# EAGLE design esp07_12_shift_inout (EAGLE 7.3.0)
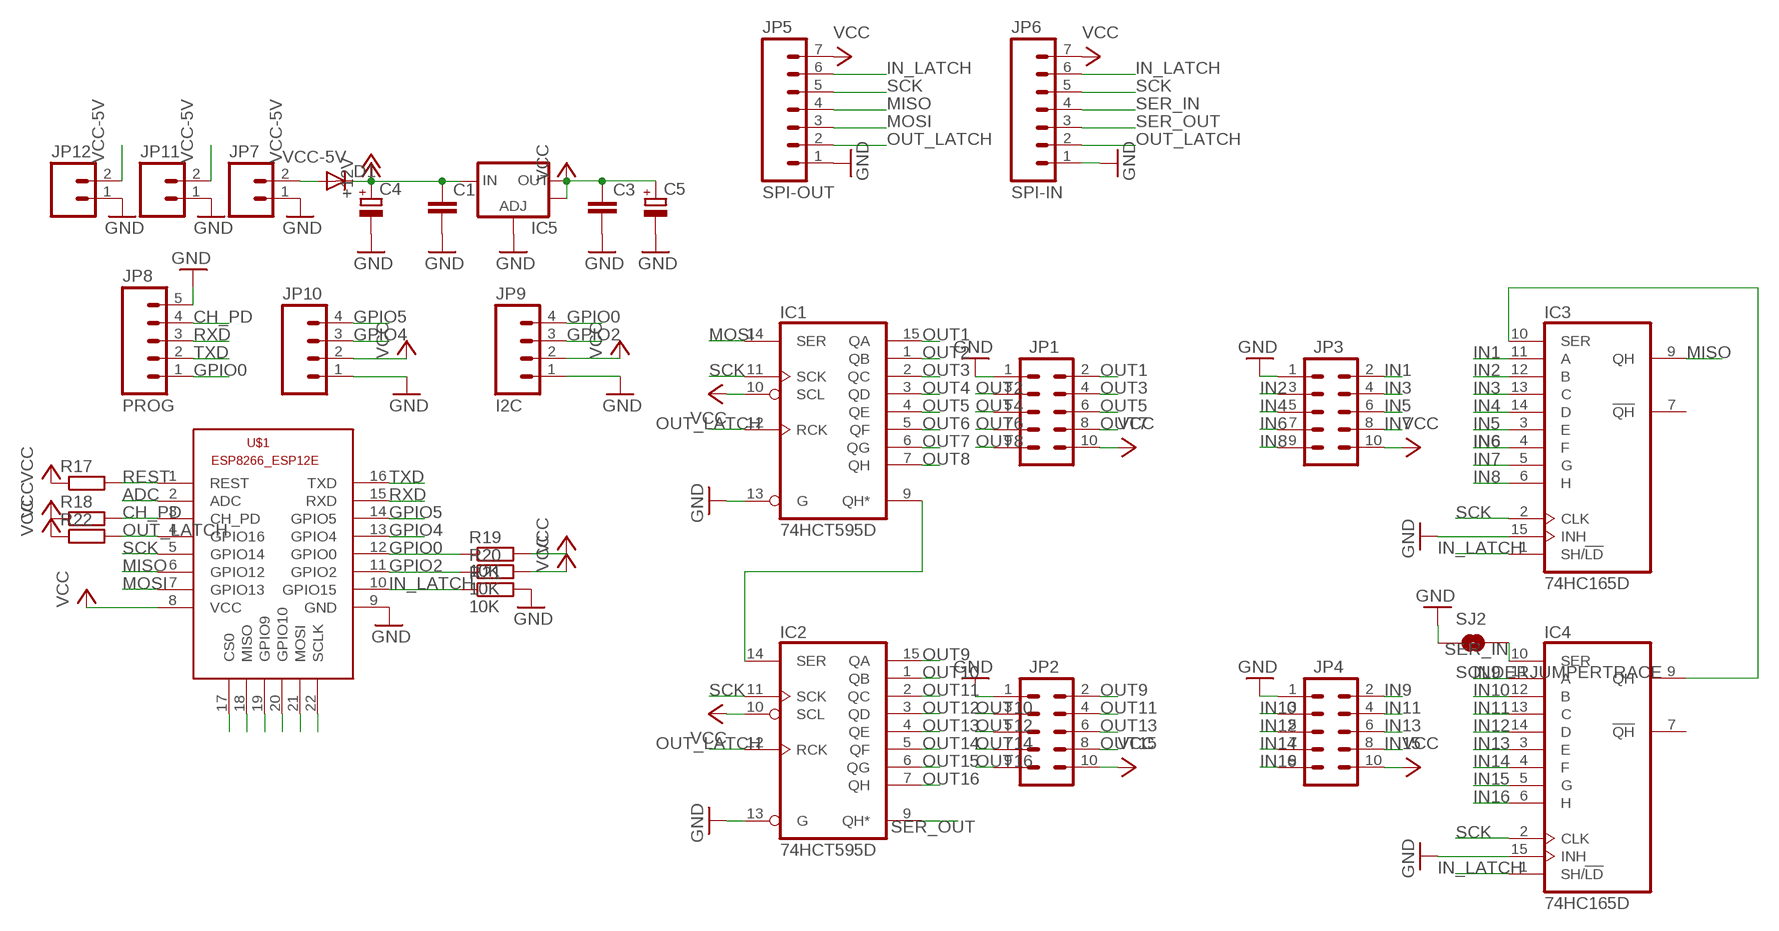
[diagram p0: schematic, sheet 1]

## Parts
C1  C-EUC0805  [C0805]
C3  C-EUC0805  [C0805]
C4  CPOL-EUD/7343-31R  [D/7343-31R]
C5  CPOL-EUD/7343-31R  [D/7343-31R]
D1  DIODE-DO214AC  [DO214AC]
IC1  74HCT595D  [SO16]
IC2  74HCT595D  [SO16]
IC3  74HC165D  [SO16]
IC4  74HC165D  [SO16]
IC5  V_REG_LM1117SOT223  [SOT223]
JP1  M05X2SHD  [2X5-SHROUDED]
JP2  M05X2SHD  [2X5-SHROUDED]
JP3  M05X2SHD  [2X5-SHROUDED]
JP4  M05X2SHD  [2X5-SHROUDED]
JP5  SPI-OUT  M07  [1X07]
JP6  SPI-IN  M07  [1X07]
JP7  M02PTH3  [1X02_LONGPADS]
JP8  PROG  M05PTH  [1X05]
JP9  I2C  M04PTH  [1X04]
JP10  M04PTH  [1X04]
JP11  M02PTH  [1X02]
JP12  M02PTH  [1X02]
R17  R-EU_R0603  [R0603]
R18  R-EU_R0603  [R0603]
R19  10K  R-EU_R0603  [R0603]
R20  10K  R-EU_R0603  [R0603]
R21  10K  R-EU_R0603  [R0603]
R22  R-EU_R0603  [R0603]
SJ2  SOLDERJUMPERTRACE  [SJ_2S-TRACE]
U$1  ESP8266-12EESP8266-ESP12E  [ESP8266-ESP12E]

## Nets
+12V: C1.1 C4.+ D1.C IC5.3(IN)
ADC: U$1.2(ADC)
CH_PD: JP8.4 R18.2 U$1.3(CH_PD)
GND: C1.2 C3.2 C4.- C5.- IC1.13(G) IC2.13(G) IC3.15(INH) IC4.15(INH) IC5.1(ADJ) JP1.1 JP2.1 JP3.1 JP4.1 JP5.1 JP6.1 JP7.1 JP8.5 JP9.1 JP10.1 JP11.1 JP12.1 R21.2 SJ2.1 U$1.9(GND)
GPIO0: JP8.1 JP9.4 R19.1 U$1.12(GPIO0)
GPIO2: JP9.3 R20.1 U$1.11(GPIO2)
GPIO4: JP10.3 U$1.13(GPIO4)
GPIO5: JP10.4 U$1.14(GPIO5)
IN1: IC3.11(A) JP3.2
IN2: IC3.12(B) JP3.3
IN3: IC3.13(C) JP3.4
IN4: IC3.14(D) JP3.5
IN5: IC3.3(E) JP3.6
IN6: IC3.4(F) JP3.7
IN7: IC3.5(G) JP3.8
IN8: IC3.6(H) JP3.9
IN9: IC4.11(A) JP4.2
IN10: IC4.12(B) JP4.3
IN11: IC4.13(C) JP4.4
IN12: IC4.14(D) JP4.5
IN13: IC4.3(E) JP4.6
IN14: IC4.4(F) JP4.7
IN15: IC4.5(G) JP4.8
IN16: IC4.6(H) JP4.9
IN_LATCH: IC3.1(SH/!LD) IC4.1(SH/!LD) JP5.6 JP6.6 R21.1 U$1.10(GPIO15)
MISO: IC3.9(QH) JP5.4 U$1.6(GPIO12)
MOSI: IC1.14(SER) JP5.3 U$1.7(GPIO13)
N$1: IC1.9(QH*) IC2.14(SER)
N$2: IC3.10(SER) IC4.9(QH)
N$35: U$1.17(CS0)
N$37: U$1.18(MISO)
N$38: U$1.19(GPIO9)
N$39: U$1.20(GPIO10)
N$40: U$1.21(MOSI)
N$41: U$1.22(SCLK)
OUT1: IC1.15(QA) JP1.2
OUT2: IC1.1(QB) JP1.3
OUT3: IC1.2(QC) JP1.4
OUT4: IC1.3(QD) JP1.5
OUT5: IC1.4(QE) JP1.6
OUT6: IC1.5(QF) JP1.7
OUT7: IC1.6(QG) JP1.8
OUT8: IC1.7(QH) JP1.9
OUT9: IC2.15(QA) JP2.2
OUT10: IC2.1(QB) JP2.3
OUT11: IC2.2(QC) JP2.4
OUT12: IC2.3(QD) JP2.5
OUT13: IC2.4(QE) JP2.6
OUT14: IC2.5(QF) JP2.7
OUT15: IC2.6(QG) JP2.8
OUT16: IC2.7(QH) JP2.9
OUT_LATCH: IC1.12(RCK) IC2.12(RCK) JP5.2 JP6.2 R22.2 U$1.4(GPIO16)
REST: R17.2 U$1.1(REST)
RXD: JP8.3 U$1.15(RXD)
SCK: IC1.11(SCK) IC2.11(SCK) IC3.2(CLK) IC4.2(CLK) JP5.5 JP6.5 U$1.5(GPIO14)
SER_IN: IC4.10(SER) JP6.4 SJ2.2
SER_OUT: IC2.9(QH*) JP6.3
TXD: JP8.2 U$1.16(TXD)
VCC: C3.1 C5.+ IC1.10(SCL) IC2.10(SCL) IC5.2(OUT) IC5.4(OUT) JP1.10 JP2.10 JP3.10 JP4.10 JP5.7 JP6.7 JP9.2 JP10.2 R17.1 R18.1 R19.2 R20.2 R22.1 U$1.8(VCC)
VCC-5V [power]: D1.A JP7.2 JP11.2 JP12.2
Unconnected: IC3.7(!QH) IC4.7(!QH)

## Power pins joined to a net without a drawn wire
GND: IC1.8(GND) IC2.8(GND) IC3.8(GND) IC4.8(GND)
VCC: IC1.16(VCC) IC2.16(VCC) IC3.16(VCC) IC4.16(VCC)

## Library data of the parts
C1 C3 = rcl:C-EU: CAPACITOR, European symbol
C4 C5 = rcl:CPOL-EU: POLARIZED CAPACITOR, European symbol
D1 = diode:DIODE-: DIODE
IC1 IC2 = 74xx-eu:74*595: 8-bit SHIFT REGISTER, output latch
IC3 IC4 = 74xx-eu:74*165: 8-bit parallel load SHIFT REGISTER
IC5 = SparkFun-PowerIC:V_REG_LM1117: Voltage Regulator LM1117 Standard adjustable voltage regulator but in SMD form. Spark Fun Electronics SKU : COM-00595
JP1-JP4 = SparkFun-Connectors:M05X2: Header 5x2 Standard 10-pin dual row 0.1" header. Commonly used with AVR-ISP. Use with Spark Fun Electronics SKU: PRT-00778
JP5 JP6 = SparkFun-Connectors:M07: Header 7 Standard 7-pin 0.1" header. Use with straight break away headers (SKU : PRT-00116), right angle break away headers (PRT-00553), swiss pins (PRT-00743), machine pins (PRT-00117), and female headers (PRT-00115). NOTES ON THE VARIANTS LOCK and LOCK_LONGPADS... This footprint was designed to help hold the alignment of a through-hole component (i.e. 7-pin header) while soldering it into place. You may notice that each hole has been shifted either up or down by 0.005 of an inch from it's more standard position (which is usually a perfectly straight line). This slight alteration caused the pins (the squares in the middle) to touch the edges of the holes. Because they are alternating, it causes a "brace" to hold the header in place. 0.005 has proven to be the perfect amount of "off-center" position when using our standard breakaway headers. Although looks a little odd when you look at the bare footprint, once you have a header in there, the alteration is very hard to notice. Also, if you push a header all the way into place, it is covered up entirely on the bottom side. This idea of altering the position of holes to aid alignment will be further integrated into the Sparkfun Library for other footprints. It can help hold any component with 3 or more connection pins.
JP7 JP11 JP12 = SparkFun-Connectors:M02: Standard 2-pin 0.1" header. Use with - straight break away headers ( PRT-00116) - right angle break away headers (PRT-00553) - swiss pins (PRT-00743) - machine pins (PRT-00117) - female headers (PRT-00115) Molex polarized connector foot print use with: PRT-08233 with associated crimp pins and housings. 2.54_SCREWTERM for use with PRT-10571. 3.5mm Screw Terminal footprints for PRT-08084 5mm Screw Terminal footprints for use with PRT-08432
JP8 = SparkFun-Connectors:M05: Header 5 Standard 5-pin 0.1" header. Use with straight break away headers (SKU : PRT-00116), right angle break away headers (PRT-00553), swiss pins (PRT-00743), machine pins (PRT-00117), and female headers (PRT-00115). Molex polarized connector foot print use with SKU : PRT-08230 with associated crimp pins and housings.
JP9 JP10 = SparkFun-Connectors:M04: Header 4 Standard 4-pin 0.1" header. Use with straight break away headers (SKU : PRT-00116), right angle break away headers (PRT-00553), swiss pins (PRT-00743), machine pins (PRT-00117), and female headers (PRT-00115). Molex polarized connector foot print use with SKU : PRT-08231 with associated crimp pins and housings. 1MM SMD Version SKU: PRT-10208
R17-R22 = rcl:R-EU_: RESISTOR, European symbol
SJ2 = SparkFun-Retired:SOLDERJUMPER: Solder Jumper Standard SMD solder jumper. Used to automate production. Two varients : Normally Open and Normally Closed are the same, but have different paste layers. NC will have a large amount of paste and should jumper during reflow.
U$1 = ESP8266-ESP12E:ESP8266-12E: ESP8266-12E with additional I/O and GPIO04/05 corrected The author cannot warrant that this library is free from error or will meet your specific requirements. Created by PuceBaboon.com. Komagane, Nagano, JAPAN

## Net classes
1 power: width 0.4 mm, clearance 0.25 mm

## Board
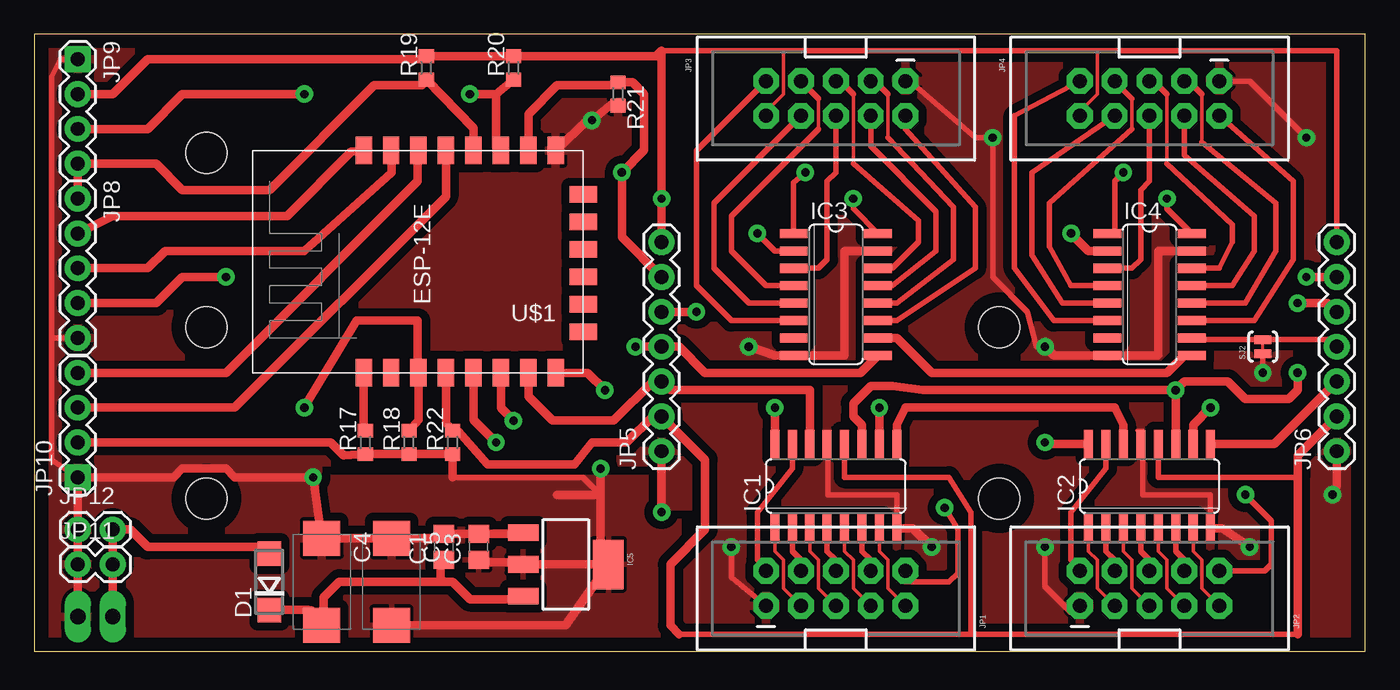
[diagram p1: board, top side]
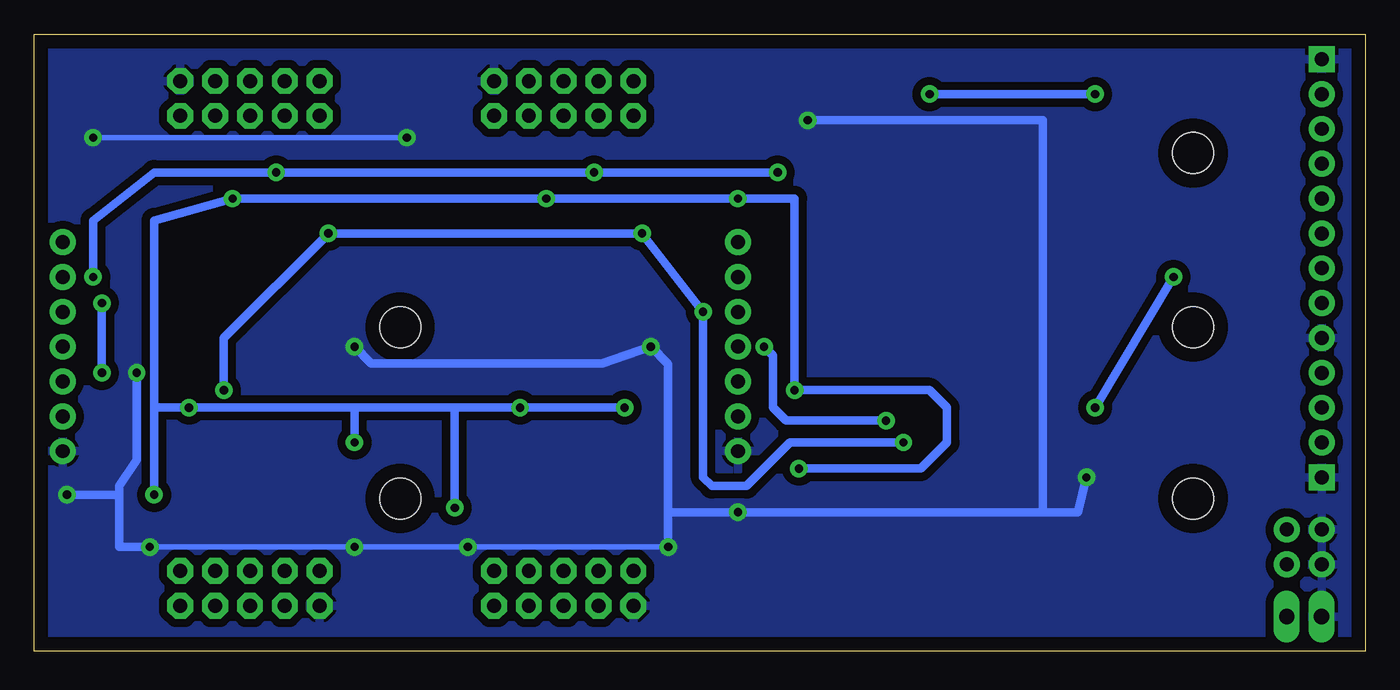
[diagram p2: board, bottom side, seen from below]

Size 97 x 45 mm. Coordinates in mm from the lower left corner, seen from the top.
Outline: 0,0 97,0 97,45 0,45 0,0
Copper layers (1*16): Top 0.035mm / dielectric 1.5mm / Bottom 0.035mm
Design rules "default *": minimum track width 10mil, minimum drill 24mil, track to track 8mil, track to pad 8mil, pad to pad 8mil, via to via 8mil, smd to smd 8mil, copper to edge 40mil, drill to drill 8mil, minimum pad ring 10mil, minimum via ring 8mil, stop-mask expansion 4mil, vias tented up to drill 0mil, thermal gap 10mil
Holes 3 mm at 70.33,11.15 70.33,23.65 12.54,11.15 12.54,23.65 12.54,36.35
tKeepout: area 65.3,2.4 to 75.3,44.9; area 7.5,2.3 to 17.5,45

### Footprints (pad centres in the part's own frame; a part is rotated, then mirrored left to right if it is on the bottom)
C0805 = smd 1.3 x 1.5: 1 -0.95,0; 2 0.95,0
D/7343-31R = smd 2.55 x 2.7: + 3.175,0; - -3.175,0
DO214AC = smd 1.8 x 1.7: A 2.05,0; C -2.05,0
SO16 = smd 0.66 x 2.032: 1 -4.445,-3.073; 2 -3.175,-3.073; 3 -1.905,-3.073; 4 -0.635,-3.073; 5 0.635,-3.073; 6 1.905,-3.073; 7 3.175,-3.073; 8 4.445,-3.073; 9 4.445,3.073; 10 3.175,3.073; 11 1.905,3.073; 12 0.635,3.073; 13 -0.635,3.073; 14 -1.905,3.073; 15 -3.175,3.073; 16 -4.445,3.073
SOT223 = smd 1.219 x 2.235: 1 -2.311,-3.099; 2 0,-3.099; 3 2.311,-3.099 | smd 3.6 x 2.2: 4 0,3.099
2X5-SHROUDED = drill 1.016 pad 1.88 octagon: 1 -1.27,5.08; 2 1.27,5.08; 3 -1.27,2.54; 4 1.27,2.54; 5 -1.27,0; 6 1.27,0; 7 -1.27,-2.54; 8 1.27,-2.54; 9 -1.27,-5.08; 10 1.27,-5.08
1X07 = drill 1.016 pad 1.88: 1 0,0; 2 2.54,0; 3 5.08,0; 4 7.62,0; 5 10.16,0; 6 12.7,0; 7 15.24,0
1X02_LONGPADS = drill 1.118 pad 1.88 long: 1 0,0; 2 2.54,0
1X05 = drill 1.016 pad 1.88: 1 0,0; 2 2.54,0; 3 5.08,0; 4 7.62,0; 5 10.16,0
1X04 = drill 1.016 pad 1.88 square: 1 0,0 | drill 1.016 pad 1.88: 2 2.54,0; 3 5.08,0; 4 7.62,0
1X02 = drill 1.016 pad 1.88: 1 0,0; 2 2.54,0
R0603 = smd 1 x 1.1: 1 -0.85,0; 2 0.85,0
SJ_2S-TRACE = smd 0.635 x 1.27: 1 -0.508,0; 2 0.508,0
ESP8266-ESP12E = smd 2 x 1.2: 1 0,16; 2 0,14; 3 0,12; 4 0,10; 5 0,8; 6 0,6; 7 0,4; 8 0,2; 9 16.2,2; 10 16.2,4; 11 16.2,6; 12 16.2,8; 13 16.2,10; 14 16.2,12; 15 16.2,14; 16 16.2,16 | smd 1.2 x 2: 17 11,0; 18 3,0; 19 5,0; 20 13,0; 21 7,0; 22 9,0

### Placement (x,y rotation side)
C1  29.84,7.62 90 top
C3  32.38,7.62 90 top
C4  20.95,5.08 270 top
C5  26.04,5.08 270 top
D1  17.14,5.08 90 top
IC1  58.42,12.06 0 top
IC2  81.28,12.06 0 top
IC3  58.42,26.04 270 top
IC4  81.28,26.04 270 top
IC5  38.73,6.35 270 top
JP1  58.42,4.6 90 top
JP2  81.28,4.6 90 top
JP3  58.42,40.32 270 top
JP4  81.28,40.32 270 top
JP5  45.72,14.61 90 top
JP6  94.92,14.61 90 top
JP7  3.17,2.54 0 top
JP8  3.17,33.02 270 top
JP9  3.17,43.18 270 top
JP10  3.17,12.7 90 top
JP11  3.17,6.35 0 top
JP12  3.17,8.89 0 top
R17  24.13,15.24 90 top
R18  27.3,15.24 90 top
R19  28.57,42.55 90 top
R20  34.92,42.55 90 top
R21  42.55,40.64 270 top
R22  30.48,15.24 90 top
SJ2  89.53,22.23 90 top
U$1  40.01,20.32 90 top

### Tracks (layer width: path | path; a pad name or v marks a point on that pad's centre or on a via)
+12V
  Top 0.254: 29.59,6.5 C1.1 | 21.09,2 C4.+
  Top 0.61: 21.09,2 21.09,3.95 22.23,5.08 29.84,5.08 | 29.84,5.08 30.48,5.08 31.75,3.81 35.41,3.81 IC5.3 | 29.59,6.5 29.59,5.33 29.84,5.08 | C4.+ arc90 19.83,3.03 D1.C
CH_PD  (via drill 0.6 pad 1.27)
  Top 0.406: 27.94,20.39 U$1.3
  Top 0.61: R18.2 28,16.89 U$1.3 | 27.94,20.39 27.94,24.13 23.5,24.13 v19.68,17.78 | JP8.4 8.89,25.4 10.79,27.3 v13.97,27.3
  Bottom 0.61: v13.97,27.3 v19.68,17.78
GND  (via drill 0.6 pad 1.27)
  Top 0.254: 80.8,14.27 80.8,14.96 IC2.13 | 79.55,21.61 IC4.8 | 83.56,29.18 84.25,29.18 IC4.15 | 80.8,16.1 80.8,15.19 IC2.13 | 62.67,9.91 62.67,9.22 IC1.8 | 80.34,16.1 80.8,16.1 | 57.85,15.87 57.85,15.19 IC1.13 | 80.8,16.1 IC2.13
  Top 0.305: 62.67,9.91 62.96,9.62 62.87,9.62
  Top 0.406: 57.85,15.87 57.85,11.43 62.87,11.43 62.87,9.62 | 85.83,8.89 arc-90 IC2.8 85.72,11.43 80.8,11.43 80.8,14.27 | SJ2.1 v89.53,20.32 | 78.97,21.61 79.55,21.61 81.92,21.61 arc-90 81.89,21.59 | R21.2 42.23,40.01 | JP10.1 1.27,13.97 1.27,22.86 | 1.27,22.86 1.27,41.91 1.91,43.18 JP9.1 | JP8.5 1.27,22.86 | JP1.1 50.8,5.4 v50.8,7.62 | JP2.1 75.56,2.86 73.66,4.76 v73.66,7.62 | JP3.1 63.82,41.59 68.58,37.47 v69.85,37.47 69.85,27.3 72.39,24.77 73.03,22.23 v73.66,22.23 | JP4.1 88.58,41.59 v92.71,37.47
  Top 0.61: v52.07,22.23 53.98,21.59 IC3.8 59.05,21.59 59.05,29.21 IC3.15 | 83.56,29.18 81.92,29.18 81.92,21.61 | IC5.1 35.55,8.57 C3.2 C1.2 29.53,8.26 C5.- C4.- v20.32,12.7 14.61,12.7 13.97,13.34 10.79,13.34 10.16,12.7 JP10.1 JP12.1 JP11.1 JP7.1 | JP6.1 94.93,12.08 v94.61,11.43 | 42.23,40.01 v40.64,38.73 40.31,38.73 U$1.9 | 81.89,21.59 74.3,21.59 v73.66,22.23 | v45.72,10.16 JP5.1 | IC2.8 86.58,8.99 v88.58,7.62 | IC1.8 64.03,8.99 v65.41,7.62
  Bottom 0.254: 52.09,22 v52.07,22.23
  Bottom 0.406: v88.58,7.62 v73.66,7.62 v65.41,7.62 v50.8,7.62 | v92.71,37.47 v69.85,37.47
  Bottom 0.61: v50.8,7.62 50.8,10.16 | v89.53,20.32 89.53,13.97 90.81,12.06 90.81,11.43 | v20.32,12.7 20.95,10.16 23.5,10.16 | 23.5,10.16 v45.72,10.16 50.8,10.16 | v40.64,38.73 23.5,38.73 23.5,10.16 | v73.66,22.23 72.44,21 55.64,21 v52.07,22.23 50.8,20.95 50.8,10.16 | 90.81,11.43 90.81,7.62 v88.58,7.62 | v94.61,11.43 90.81,11.43
  pour Top (isolate 0.6, rank 4): 0,0 0,45.72 97.79,45.72 97.79,0
  pour Bottom (isolate 0.6, rank 4): 0,0 0,45.72 97.79,45.72 97.79,0
GPIO0
  Top 0.61: JP8.1 JP9.4 8.89,35.56 10.79,33.66 17.14,33.66 24.77,41.27 28.25,41.27 R19.1 32.01,38.16 U$1.12
GPIO2  (via drill 0.6 pad 1.27)
  Top 0.61: R20.1 33.66,40.64 | 33.66,40.64 33.66,36.78 U$1.11 | v31.75,40.64 33.66,40.64 | JP9.3 8.26,38.1 10.79,40.64 v19.68,40.64
  Bottom 0.61: v31.75,40.64 v19.68,40.64
GPIO4
  Top 0.61: U$1.13 30,33.18 14.61,17.78 JP10.3
GPIO5
  Top 0.406: 27.94,36.45 U$1.14
  Top 0.61: JP10.4 13.97,20.32 27.94,34.29 27.94,36.45
IN1
  Top 0.406: JP3.2 63.5,38.1 68.58,32.38 68.58,27.94 62.87,24.13 IC3.11
IN2
  Top 0.254: 62.23,40.64 62.23,37.47
  Top 0.406: JP3.3 61.28,41.59 62.23,40.64 | 62.23,37.47 66.99,32.38 66.99,28.57 62.87,25.4 IC3.12
IN3
  Top 0.406: JP3.4 60.96,36.83 65.72,32.07 65.72,29.21 62.55,26.67 IC3.13
IN4
  Top 0.254: 59.69,40.64 59.69,35.56
  Top 0.406: JP3.5 58.74,41.59 59.69,40.64 | 59.69,35.56 64.45,31.43 64.45,29.84 62.55,27.94 IC3.14
IN5
  Top 0.406: IC3.3 57.15,27.94 57.78,28.57 57.78,34.29 58.42,34.92 JP3.6
IN6
  Top 0.254: 57.15,38.1 57.15,40.32
  Top 0.406: IC3.4 53.34,26.67 50.8,29.21 50.8,31.75 57.15,38.1 | 57.15,40.32 JP3.7
IN7
  Top 0.406: IC3.5 52.07,25.4 49.53,27.94 49.53,32.7 JP3.8
IN8
  Top 0.406: IC3.6 50.8,24.13 48.26,26.67 48.26,36.51 JP3.9
IN9
  Top 0.406: IC4.11 88.9,24.13 91.76,28.57 91.76,34.29 JP4.2
IN10
  Top 0.254: 85.09,40.64 85.09,37.15
  Top 0.406: JP4.3 84.14,41.59 85.09,40.64 | 85.09,37.15 90.49,32.7 90.49,29.21 88.27,25.4 IC4.12
IN11
  Top 0.406: JP4.4 83.82,36.2 88.9,31.75 88.9,29.21 87.31,26.67 IC4.13
IN12
  Top 0.254: 82.55,40.64 82.55,35.56
  Top 0.406: JP4.5 81.6,41.59 82.55,40.64 | 82.55,35.56 87.31,31.11 87.31,29.84 86.36,27.94 IC4.14
IN13
  Top 0.406: IC4.3 80.01,27.94 80.64,28.57 80.64,33.66 81.28,34.29 JP4.6
IN14
  Top 0.254: 80.01,38.1 80.01,40.32
  Top 0.406: IC4.4 75.56,26.67 73.98,29.53 73.98,32.7 80.01,38.1 | 80.01,40.32 JP4.7
IN15
  Top 0.406: IC4.5 74.93,25.4 72.71,28.89 72.71,34.92 JP4.8
IN16
  Top 0.406: IC4.6 74.3,24.13 71.44,27.94 71.44,39.05 JP4.9
IN_LATCH  (via drill 0.6 pad 1.27)
  Top 0.406: 78.11,30.48 IC4.1 78.74,30.48 78.74,34.29 v79.38,34.92 | IC3.1 55.35,34.19 v56.2,34.92 | 42.23,41.27 R21.1
  Top 0.61: JP6.6 v92.71,27.3 | JP5.6 42.83,30.2 v42.83,34.92 44.45,36.55 44.45,40.64 43.6,41.49 R21.1 | U$1.10 36.01,39.18 38.1,41.27 42.23,41.27
  Bottom 0.254: 42.83,35 v42.83,34.92
  Bottom 0.406: 43.81,34.92 v42.83,34.92
  Bottom 0.61: v42.83,34.92 v56.2,34.92 v79.38,34.92 88.27,34.92 92.71,31.43 v92.71,27.3
MISO  (via drill 0.6 pad 1.27)
  Top 0.61: IC3.9 60.22,20.32 48.9,20.32 46.99,22.23 JP5.4 v43.81,22.23 | U$1.6 34.01,17.75 v34.92,16.83
  Bottom 0.61: v34.92,16.83 42.23,16.83 43.18,17.78 43.18,21.59 v43.81,22.23
MOSI
  Top 0.61: IC1.14 56.52,19.05 46.35,19.05 JP5.3 45.09,19.68 42.23,16.83 37.78,16.83 36.01,18.61 U$1.7
N$1
  Top 0.61: IC1.9 62.87,16.51 63.5,17.78 78.74,17.78 79.38,16.51 IC2.14
N$2
  Top 0.406: 83.82,21.59 IC4.9
  Top 0.61: 83.82,21.59 82.55,20.32 65.41,20.32 62.87,22.86 IC3.10
OUT1
  Top 0.406: IC1.15 55.24,13.34 52.7,10.16 52.7,6.67 JP1.2
OUT2
  Top 0.254: IC1.1 53.98,7.3 54.61,6.67 54.61,4.6 JP1.3
OUT3
  Top 0.406: JP1.4 55.88,6.67 55.24,7.3 IC1.2
OUT4
  Top 0.254: IC1.3 56.52,7.3 57.15,6.67 57.15,4.6 JP1.5
OUT5
  Top 0.406: JP1.6 58.42,6.67 57.78,7.3 IC1.4
OUT6
  Top 0.254: IC1.5 59.05,7.3 59.69,6.67 59.69,4.6 JP1.7
OUT7
  Top 0.406: JP1.8 60.96,6.67 60.33,7.3 IC1.6
OUT8
  Top 0.254: IC1.7 61.59,7.3 62.23,6.67 62.23,4.6 JP1.9
OUT9
  Top 0.406: IC2.15 78.11,13.34 75.56,10.16 75.56,6.67 JP2.2
OUT10
  Top 0.254: IC2.1 76.83,7.3 77.47,6.67 77.47,4.6 JP2.3
OUT11
  Top 0.406: JP2.4 78.74,6.67 78.11,7.3 IC2.2
OUT12
  Top 0.254: IC2.3 79.38,7.3 80.01,6.67 80.01,4.6 JP2.5
OUT13
  Top 0.406: JP2.6 81.28,6.67 80.64,7.3 IC2.4
OUT14
  Top 0.254: IC2.5 81.92,7.3 82.55,6.67 82.55,4.6 JP2.7
OUT15
  Top 0.406: JP2.8 83.82,6.67 83.19,7.3 IC2.6
OUT16
  Top 0.254: IC2.7 84.45,7.3 85.09,6.67 85.09,4.6 JP2.9
OUT_LATCH
  Top 0.406: 46.99,1.27 68.26,1.27 | 68.26,1.27 92.08,1.27 | 92.08,12.7 81.92,12.7 IC2.12 | IC1.12 59.05,12.7 66.67,12.7 68.26,10.16 68.26,1.27 | R22.2 30.9,16.09
  Top 0.61: 92.08,1.27 92.08,12.7 92.08,14.3 JP6.2 | 46.99,1.27 46.35,1.91 46.35,6.35 48.9,8.89 48.9,13.97 JP5.2 45.09,17.14 43.18,15.24 40.64,15.24 39.37,13.65 33.02,13.65 30.9,16.09 | R22.2 30,16.66 U$1.4
REST
  Top 0.406: R17.2 24,16.32
  Top 0.61: 24,16.32 U$1.1
RXD
  Top 0.406: 26.04,36.4 U$1.15
  Top 0.61: JP8.3 8.26,27.94 9.53,29.21 19.68,29.21 26.04,34.92 26.04,36.4
SCK  (via drill 0.6 pad 1.27)
  Top 0.406: IC3.2 53.98,29.21 v52.7,30.48 | JP6.5 94.28,25.4
  Top 0.61: v48.26,24.77 JP5.5 | IC4.2 76.83,29.21 v75.56,30.48 | v83.19,19.05 IC2.11 | 94.28,25.4 v92.08,25.4 | v83.19,19.05 83.82,19.68 87,19.68 88.27,18.41 91.44,18.41 92.08,19.05 v92.08,20.32 | U$1.5 32.01,16.89 v33.66,15.24 | v83.19,19.05 64.77,19.05 62.55,19.37 60.96,19.37 59.69,18.1 59.69,17.14 60.33,16.51 IC1.11
  Bottom 0.61: v83.19,19.05 83.19,22.86 v75.56,30.48 v52.7,30.48 v48.26,24.77 48.26,12.7 47.62,12.06 45.09,12.06 41.91,15.24 v33.66,15.24 | v92.08,25.4 v92.08,20.32
SER_IN
  Top 0.406: JP6.4 94.41,22.73 SJ2.2 84.48,22.73 IC4.10
SER_OUT
  Top 0.61: JP6.3 90.37,15.14 IC2.9
TXD
  Top 0.61: U$1.16 23.09,36.43 18.41,31.75 5.71,31.75 JP8.2
VCC  (via drill 0.6 pad 1.27)
  Top 0.254: 60.61,30.33 61.3,30.33 IC3.16 | 83.56,30.33 84.25,30.33 IC4.16 | 84.47,15.19 IC2.10 | 61.75,14.27 61.75,14.96 IC1.10 | 76.67,14.96 IC2.16 | 32.59,6.5 C3.1 | 35.59,6.5 IC5.2 | 41.59,6.5 IC5.4 | JP3.10 53.34,39.37 54.61,40.64 54.61,43.81 | JP4.10 76.2,39.37 77.47,40.64 77.47,43.81
  Top 0.305: 73.76,15.14 v73.66,15.24
  Top 0.406: 83.56,30.33 84.45,30.33 | 61.59,30.48 IC3.16 59.69,32.28 v59.69,33.02 | v41.27,13.34 41.27,13.46 | 30.48,12.7 40.01,12.7 41.27,11.43 | JP6.7 94.93,29.84 94.93,43.81 77.47,43.81 54.61,43.81 45.72,43.81 | IC4.16 82.55,32.28 v82.55,33.02 | v66.36,10.48 67.31,8.89 67.31,5.71 66.67,5.08 63.5,5.08 JP1.10 | JP2.10 89.69,5.87 90.17,6.35 90.17,9.53 v88.27,11.43
  Top 0.61: IC1.10 v61.59,17.78 | v53.98,17.78 IC1.16 | JP5.7 v45.72,33.02 45.72,43.81 45.3,43.4 R20.2 R19.2 28.26,43.18 8.26,43.18 5.71,40.64 JP9.2 | v85.72,17.78 84.45,16.51 IC2.10 | 35.59,6.5 32.59,6.5 | C5.+ 38.73,1.91 IC5.4 IC5.2 | 41.59,6.5 41.27,6.5 41.27,11.43 | 41.27,11.43 v41.27,13.34 | JP10.2 21.59,15.24 22.54,14.29 R17.1 R18.1 R22.1 30.48,12.7 | 38.1,11.43 41.27,11.43 | U$1.8 40.32,20.32 v41.59,19.05 | IC2.16 73.76,15.14
  Bottom 0.61: v53.98,17.78 v61.59,17.78 66.36,17.78 | 73.66,17.78 v85.72,17.78 88.27,17.78 | 73.66,17.78 66.36,17.78 | 88.27,17.78 88.27,31.43 v82.55,33.02 v59.69,33.02 v45.72,33.02 41.59,33.02 v41.59,19.05 31.75,19.05 30.48,17.78 30.48,15.24 32.38,13.34 v41.27,13.34 | v88.27,11.43 88.27,17.78 | v66.36,10.48 66.36,17.78 | v73.66,15.24 73.66,17.78
  pour Top (isolate 0.6, rank 3): 46.99,12.7 15.24,12.7 15.24,0 46.99,0
VCC-5V
  Top 0.61: JP7.2 JP11.2 JP12.2 6.99,8.89 8.26,7.62 16.66,7.62 D1.A